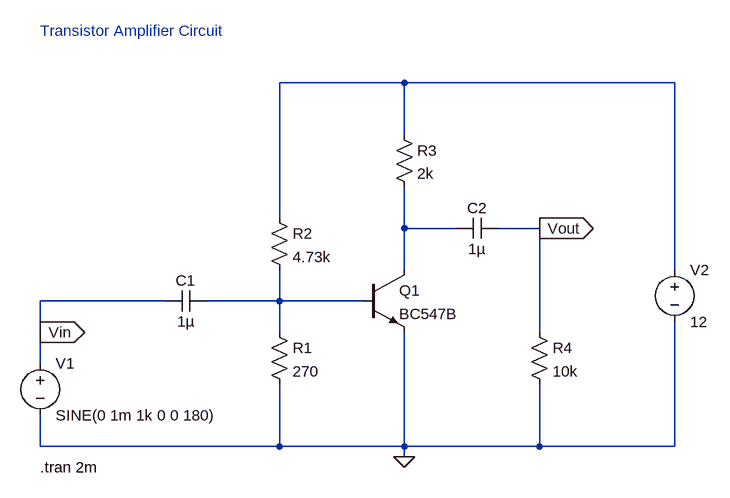
[diagram p0: schematic AMPLI.asc]
AMPLI.asc, the LTspice schematic file:
Version 4.1
SHEET 1 1072 680
WIRE 544 -288 352 -288
WIRE 960 -288 544 -288
WIRE 544 -208 544 -288
WIRE 352 -80 352 -288
WIRE 544 -64 544 -128
WIRE 624 -64 544 -64
WIRE 752 -64 688 -64
WIRE 544 0 544 -64
WIRE 960 0 960 -288
WIRE 176 48 -16 48
WIRE 352 48 352 0
WIRE 352 48 240 48
WIRE 480 48 352 48
WIRE -16 96 -16 48
WIRE 352 96 352 48
WIRE 752 96 752 -64
WIRE -16 144 -16 96
WIRE -16 272 -16 224
WIRE 352 272 352 176
WIRE 352 272 -16 272
WIRE 544 272 544 96
WIRE 544 272 352 272
WIRE 752 272 752 176
WIRE 752 272 544 272
WIRE 960 272 960 80
WIRE 960 272 752 272
WIRE 544 288 544 272
FLAG 544 288 0
FLAG 752 -64 Vout
IOPIN 752 -64 Out
FLAG -16 96 Vin
IOPIN -16 96 Out
SYMBOL voltage -16 128 R0
WINDOW 123 0 0 Left 0
WINDOW 39 0 0 Left 0
SYMATTR InstName V1
SYMATTR Value SINE(0 1m 1k 0 0 180)
SYMBOL voltage 960 -16 R0
WINDOW 123 0 0 Left 0
WINDOW 39 24 124 Left 2
SYMATTR InstName V2
SYMATTR Value 12
SYMBOL npn 480 0 R0
SYMATTR InstName Q1
SYMATTR Value BC547B
SYMBOL res 336 80 R0
SYMATTR InstName R1
SYMATTR Value 270
SYMBOL res 336 -96 R0
SYMATTR InstName R2
SYMATTR Value 4.73k
SYMBOL cap 240 32 R90
WINDOW 0 0 32 VBottom 2
WINDOW 3 32 32 VTop 2
SYMATTR InstName C1
SYMATTR Value 1µ
SYMBOL res 528 -224 R0
SYMATTR InstName R3
SYMATTR Value 2k
SYMBOL res 736 80 R0
SYMATTR InstName R4
SYMATTR Value 10k
SYMBOL cap 688 -80 R90
WINDOW 0 0 32 VBottom 2
WINDOW 3 32 32 VTop 2
SYMATTR InstName C2
SYMATTR Value 1µ
TEXT -16 304 Left 2 !.tran 2m
TEXT -16 -368 Left 2 ;Transistor Amplifier Circuit

The netlist it stands for:
* AMPLI.asc
V1 Vin 0 SINE(0 1m 1k 0 0 180)
V2 N001 0 12
Q1 N002 N003 0 0 BC547B
R1 N003 0 270
R2 N001 N003 4.73k
C1 N003 Vin 1µ
R3 N001 N002 2k
R4 Vout 0 10k
C2 Vout N002 1µ
.model NPN NPN
.model PNP PNP
.lib standard.bjt
.tran 2m
* Transistor Amplifier Circuit
.backanno
.end